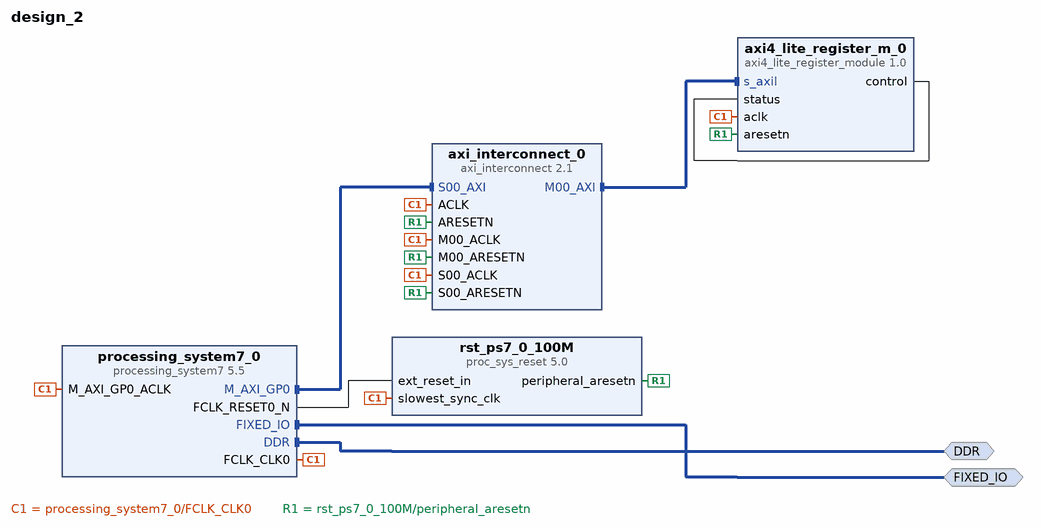
[diagram p0: block diagram of the top level]
# Vivado block design design_2, xc7z010clg400-1, Vivado 2019.2
create_bd_design design_2

create_bd_intf_port -mode Master -vlnv xilinx.com:interface:ddrx_rtl:1.0 DDR
create_bd_intf_port -mode Master -vlnv xilinx.com:display_processing_system7:fixedio_rtl:1.0 FIXED_IO

create_bd_cell -type ip -vlnv xilinx.com:ip:processing_system7:5.5 processing_system7_0
set_property -dict [list \
  CONFIG.PCW_APU_PERIPHERAL_FREQMHZ 650 \
  CONFIG.PCW_CRYSTAL_PERIPHERAL_FREQMHZ 50.000000 \
  CONFIG.PCW_ENET0_ENET0_IO {MIO 16 .. 27} \
  CONFIG.PCW_ENET0_GRP_MDIO_ENABLE 1 \
  CONFIG.PCW_ENET0_GRP_MDIO_IO {MIO 52 .. 53} \
  CONFIG.PCW_ENET0_PERIPHERAL_ENABLE 1 \
  CONFIG.PCW_ENET0_RESET_ENABLE 0 \
  CONFIG.PCW_ENET_RESET_ENABLE 1 \
  CONFIG.PCW_ENET_RESET_SELECT {Share reset pin} \
  CONFIG.PCW_FPGA0_PERIPHERAL_FREQMHZ 100 \
  CONFIG.PCW_FPGA1_PERIPHERAL_FREQMHZ 50 \
  CONFIG.PCW_GP0_EN_MODIFIABLE_TXN 0 \
  CONFIG.PCW_GP1_EN_MODIFIABLE_TXN 0 \
  CONFIG.PCW_GPIO_MIO_GPIO_ENABLE 1 \
  CONFIG.PCW_GPIO_MIO_GPIO_IO MIO \
  CONFIG.PCW_I2C_RESET_ENABLE 1 \
  CONFIG.PCW_PERIPHERAL_BOARD_PRESET part0 \
  CONFIG.PCW_PRESET_BANK1_VOLTAGE {LVCMOS 1.8V} \
  CONFIG.PCW_QSPI_GRP_FBCLK_ENABLE 1 \
  CONFIG.PCW_QSPI_GRP_FBCLK_IO {MIO 8} \
  CONFIG.PCW_QSPI_GRP_SINGLE_SS_ENABLE 1 \
  CONFIG.PCW_QSPI_GRP_SINGLE_SS_IO {MIO 1 .. 6} \
  CONFIG.PCW_QSPI_PERIPHERAL_ENABLE 1 \
  CONFIG.PCW_QSPI_QSPI_IO {MIO 1 .. 6} \
  CONFIG.PCW_SD0_GRP_CD_ENABLE 1 \
  CONFIG.PCW_SD0_GRP_CD_IO {MIO 47} \
  CONFIG.PCW_SD0_GRP_WP_ENABLE 1 \
  CONFIG.PCW_SD0_GRP_WP_IO EMIO \
  CONFIG.PCW_SD0_PERIPHERAL_ENABLE 1 \
  CONFIG.PCW_SD0_SD0_IO {MIO 40 .. 45} \
  CONFIG.PCW_SDIO_PERIPHERAL_FREQMHZ 50 \
  CONFIG.PCW_SINGLE_QSPI_DATA_MODE x4 \
  CONFIG.PCW_TTC0_PERIPHERAL_ENABLE 1 \
  CONFIG.PCW_TTC0_TTC0_IO EMIO \
  CONFIG.PCW_UART1_PERIPHERAL_ENABLE 1 \
  CONFIG.PCW_UART1_UART1_IO {MIO 48 .. 49} \
  CONFIG.PCW_UART_PERIPHERAL_FREQMHZ 100 \
  CONFIG.PCW_UIPARAM_DDR_FREQ_MHZ 525 \
  CONFIG.PCW_UIPARAM_DDR_PARTNO {MT41K128M16 JT-125} \
  CONFIG.PCW_USB0_PERIPHERAL_ENABLE 1 \
  CONFIG.PCW_USB0_RESET_ENABLE 1 \
  CONFIG.PCW_USB0_RESET_IO {MIO 46} \
  CONFIG.PCW_USB0_USB0_IO {MIO 28 .. 39} \
  CONFIG.PCW_USB_RESET_ENABLE 1 \
  CONFIG.PCW_USB_RESET_SELECT {Share reset pin} \
] [get_bd_cells processing_system7_0]
# 499 more settings of processing_system7_0 are not shown: defaults, MIO pin electricals, DDR timing, and values the tool derives
create_bd_cell -type ip -vlnv xilinx.com:ip:axi_interconnect:2.1 axi_interconnect_0
set_property -dict {CONFIG.NUM_MI 1} [get_bd_cells axi_interconnect_0]
create_bd_cell -type ip -vlnv xilinx.com:ip:proc_sys_reset:5.0 rst_ps7_0_100M
create_bd_cell -type ip -vlnv xilinx.com:user:axi4_lite_register_module:1.0 axi4_lite_register_m_0

# ---- connections ----

connect_bd_intf_net [get_bd_intf_pins axi_interconnect_0/M00_AXI] [get_bd_intf_pins axi4_lite_register_m_0/s_axil]
connect_bd_intf_net [get_bd_intf_pins processing_system7_0/M_AXI_GP0] [get_bd_intf_pins axi_interconnect_0/S00_AXI]
connect_bd_intf_net [get_bd_intf_ports FIXED_IO] [get_bd_intf_pins processing_system7_0/FIXED_IO]
connect_bd_intf_net [get_bd_intf_ports DDR] [get_bd_intf_pins processing_system7_0/DDR]
connect_bd_net [get_bd_pins processing_system7_0/FCLK_CLK0] \
  [get_bd_pins axi_interconnect_0/ACLK] [get_bd_pins rst_ps7_0_100M/slowest_sync_clk] \
  [get_bd_pins axi4_lite_register_m_0/aclk] [get_bd_pins axi_interconnect_0/M00_ACLK] \
  [get_bd_pins axi_interconnect_0/S00_ACLK] [get_bd_pins processing_system7_0/M_AXI_GP0_ACLK]
connect_bd_net [get_bd_pins processing_system7_0/FCLK_RESET0_N] [get_bd_pins rst_ps7_0_100M/ext_reset_in]
connect_bd_net [get_bd_pins rst_ps7_0_100M/peripheral_aresetn] \
  [get_bd_pins axi_interconnect_0/ARESETN] [get_bd_pins axi4_lite_register_m_0/aresetn] \
  [get_bd_pins axi_interconnect_0/M00_ARESETN] [get_bd_pins axi_interconnect_0/S00_ARESETN]
connect_bd_net [get_bd_pins axi4_lite_register_m_0/control] [get_bd_pins axi4_lite_register_m_0/status]

# ---- address map ----
assign_bd_address -offset 0x40000000 -range 1G -target_address_space [get_bd_addr_spaces processing_system7_0/Data] [get_bd_addr_segs axi4_lite_register_m_0/s_axil/reg0]

validate_bd_design
save_bd_design
